# EAGLE schematic ItsyBitsy_Expander_v2.1_RP2040 (EAGLE 9.6.2)
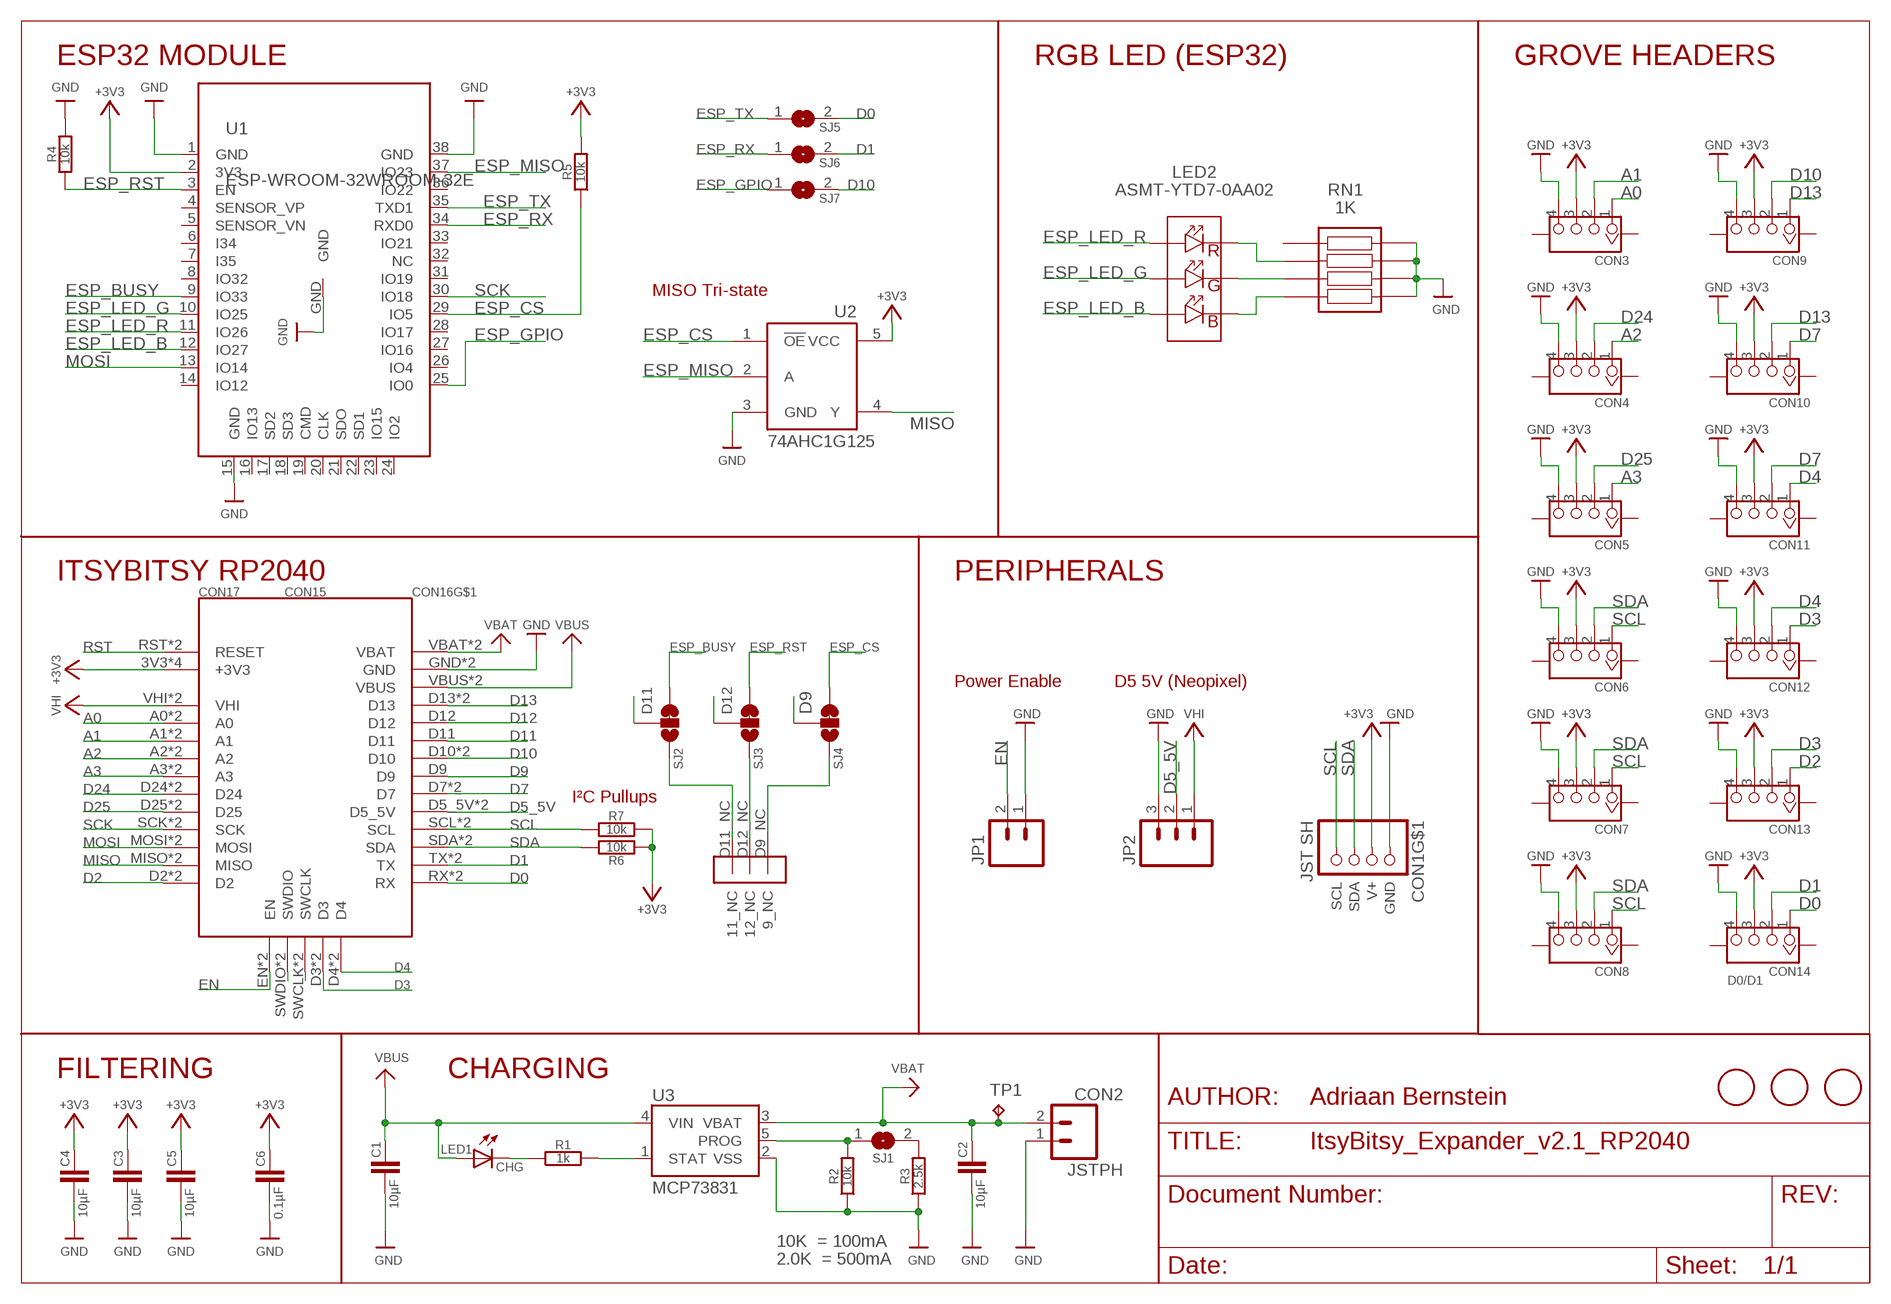
[diagram p0: schematic, sheet 1]

## Parts
C1  10µF  C-EUC0805  [C0805]
C2  10µF  C-EUC0805  [C0805]
C3  10µF  C-EUC0805  [C0805]
C4  10µF  C-EUC0805  [C0805]
C5  10µF  C-EUC0805  [C0805]
C6  0.1µF  C-EUC0805  [C0805]
CON1  JST SH  STEMMA_I2C_QT  [JST_SH4]
CON2  JSTPH  M02-JST-2MM-SMT  [JST-2-SMD]
CON3  H4P-SMD-2.0  GROVE-CONNECTOR-4PINHW4-PTH-2.0  [HW4-PTH-2.0]
CON4  H4P-SMD-2.0  GROVE-CONNECTOR-4PINHW4-PTH-2.0  [HW4-PTH-2.0]
CON5  H4P-SMD-2.0  GROVE-CONNECTOR-4PINHW4-PTH-2.0  [HW4-PTH-2.0]
CON6  H4P-SMD-2.0  GROVE-CONNECTOR-4PINHW4-PTH-2.0  [HW4-PTH-2.0]
CON7  H4P-SMD-2.0  GROVE-CONNECTOR-4PINHW4-PTH-2.0  [HW4-PTH-2.0]
CON8  H4P-SMD-2.0  GROVE-CONNECTOR-4PINHW4-PTH-2.0  [HW4-PTH-2.0]
CON9  H4P-SMD-2.0  GROVE-CONNECTOR-4PINHW4-PTH-2.0  [HW4-PTH-2.0]
CON10  H4P-SMD-2.0  GROVE-CONNECTOR-4PINHW4-PTH-2.0  [HW4-PTH-2.0]
CON11  H4P-SMD-2.0  GROVE-CONNECTOR-4PINHW4-PTH-2.0  [HW4-PTH-2.0]
CON12  H4P-SMD-2.0  GROVE-CONNECTOR-4PINHW4-PTH-2.0  [HW4-PTH-2.0]
CON13  H4P-SMD-2.0  GROVE-CONNECTOR-4PINHW4-PTH-2.0  [HW4-PTH-2.0]
CON14  H4P-SMD-2.0  GROVE-CONNECTOR-4PINHW4-PTH-2.0  [HW4-PTH-2.0]
CON15  ITSYBITSY_RP2040_EDGEDEBUG  [ITSYBITSY_RP2040_PTH_EDGEDEBUG]
CON16  ITSYBITSY_RP2040_EDGEGND  [ITSYBITSY_RP2040_SMD_EDGEGND]
CON17  ITSYBITSY_RP2040_EDGEPWR  [ITSYBITSY_RP2040_SMD_EDGEPWR]
FD1  FIDUCIAL  [FIDUCIAL_1MM]
FD2  FIDUCIAL  [FIDUCIAL_1MM]
FD3  FIDUCIAL  [FIDUCIAL_1MM]
JP1  M02PTH  [1X02]
JP2  M03PTH  [1X03]
LED1  CHG  LEDCHIP-LED0603  [CHIP-LED0603]
LED2  ASMT-YTD7-0AA02  [ASMTYTD70AA02]
R1  1k  R-EU_R0603  [R0603]
R2  10k  R-EU_R0603  [R0603]
R3  2.5k  R-EU_R0603  [R0603]
R4  10k  R-EU_R0603  [R0603]
R5  10k  R-EU_R0603  [R0603]
R6  10k  R-EU_R0603  [R0603]
R7  10k  R-EU_R0603  [R0603]
RN1  1K  CAY16-221J4AS  [CAY1647R0F4LF]
SJ1  SJ  [SJ]
SJ5  SJ  [SJ]
SJ6  SJ  [SJ]
SJ7  SJ  [SJ]
SJ_D11  SJ2  SJ_2WAY_CLOSED  [SJ_2WAY_CLOSED]
SJ_D12  SJ3  SJ_2WAY_CLOSED  [SJ_2WAY_CLOSED]
SJ_D13  SJ4  SJ_2WAY_CLOSED  [SJ_2WAY_CLOSED]
TP1  TPB1,27  [B1,27]
U1  ESP-WROOM-32WROOM-32E  [ESP-WROOM-32E]
U2  74AHC1G125  [SOT23-5L]
U3  MCP73831  [SOT23-5]

## Nets
2.5K: R3.2 SJ1.2
10K: R2.2 SJ1.1 U3.5(PROG)
+3V3: C3.1 C4.1 C5.1 C6.1 CON1.2(V+) CON3.3 CON4.3 CON5.3 CON6.3 CON7.3 CON8.3 CON9.3 CON10.3 CON11.3 CON12.3 CON13.3 CON14.3 CON17.3V3(+3V3) CON17.3V3_2(+3V3) CON17.3V3_3(+3V3) CON17.3V3_4(+3V3) R5.2 R6.1 R7.1 U1.2(3V3) U2.5(VCC)
+5V: CON17.VHI CON17.VHI_2(VHI) JP2.1 ; supply symbol labelled VHI
A0: CON3.1 CON17.A0 CON17.A0_2(A0)
A1: CON3.2 CON17.A1 CON17.A1_2(A1)
A2: CON4.1 CON17.A2 CON17.A2_2(A2)
A3: CON5.1 CON17.A3 CON17.A3_2(A3)
CHG: LED1.C R1.1
D0: CON14.1 CON15.RX CON15.RX_2(RX) SJ5.2
D1: CON14.2 CON16.TX CON16.TX_2(TX) SJ6.2
D2: CON13.1 CON15.D2 CON15.D2_2(D2)
D3: CON12.1 CON13.2 CON15.D3 CON15.D3_2(D3)
D4: CON11.1 CON12.2 CON15.D4 CON15.D4_2(D4)
D5_5V: CON16.D5_5V CON16.D5_5V_2(D5_5V) JP2.2
D7: CON10.1 CON11.2 CON16.D7 CON16.D7_2(D7)
D9: CON16.D9 SJ_D13.2
D9_NC: CON16.D9_NC(9_NC) SJ_D13.3
D10: CON9.2 CON16.D10 CON16.D10_2(D10) SJ7.2
D11: CON16.D11 SJ_D11.2
D11_NC: CON16.D11_NC(11_NC) SJ_D11.3
D12: CON16.D12 SJ_D12.2
D12_NC: CON16.D12_NC(12_NC) SJ_D12.3
D13: CON9.1 CON10.2 CON16.D13 CON16.D13_2(D13)
D24: CON4.2 CON17.D24 CON17.D24_2(D24)
D25: CON5.2 CON17.D25 CON17.D25_2(D25)
EN: CON15.EN CON15.EN_2(EN) JP1.2
ESP_BUSY: SJ_D11.1 U1.9(IO33)
ESP_CS: R5.1 SJ_D13.1 U1.29(IO5) U2.1(!OE)
ESP_GPIO: SJ7.1 U1.25(IO0)
ESP_LED_B: LED2.6(A_BLUE) U1.12(IO27)
ESP_LED_G: LED2.5(A_GREEN) U1.10(IO25)
ESP_LED_R: LED2.4(A_RED) U1.11(IO26)
ESP_MISO: U1.37(IO23) U2.2(A)
ESP_RST: R4.1 SJ_D12.1 U1.3(EN)
ESP_RX: SJ6.1 U1.34(RXD0)
ESP_TX: SJ5.1 U1.35(TXD1)
GND: C1.2 C2.2 C3.2 C4.2 C5.2 C6.2 CON1.1(GND) CON2.1 CON3.4 CON4.4 CON5.4 CON6.4 CON7.4 CON8.4 CON9.4 CON10.4 CON11.4 CON12.4 CON13.4 CON14.4 CON16.GND CON16.GND_2(GND) JP1.1 JP2.3 R2.1 R3.1 R4.2 RN1.5(R4_2) RN1.6(R3_2) RN1.7(R2_2) RN1.8(R1_2) U1.1(GND) U1.15(GND) U1.38(GND) U1.GND U2.3(GND) U3.2(VSS)
MISO: CON17.MISO CON17.MISO_2(MISO) U2.4(Y)
MOSI: CON17.MOSI CON17.MOSI_2(MOSI) U1.13(IO14)
N$1: LED2.2(K_GREEN) RN1.3(R3_1)
N$2: LED2.1(K_BLUE) RN1.4(R4_1)
N$3: LED2.3(K_RED) RN1.2(R2_1)
N$5: CON15.SWDIO CON15.SWDIO_2(SWDIO)
N$6: CON15.SWCLK CON15.SWCLK_2(SWCLK)
RST: CON17.RST(RESET) CON17.RST_2(RESET)
SCK: CON17.SCK CON17.SCK_2(SCK) U1.30(IO18)
SCL: CON1.4(SCL) CON6.1 CON7.1 CON8.1 CON16.SCL CON16.SCL_2(SCL) R7.2
SDA: CON1.3(SDA) CON6.2 CON7.2 CON8.2 CON16.SDA CON16.SDA_2(SDA) R6.2
STAT: R1.2 U3.1(STAT)
VBAT: C2.1 CON2.2 CON16.VBAT CON16.VBAT_2(VBAT) TP1.TP U3.3(VBAT)
VBUS: C1.1 CON16.VBUS CON16.VBUS_2(VBUS) LED1.A U3.4(VIN)
Unconnected: CON1.MT1(MT) CON1.MT2(MT) CON3.5(SS1) CON3.6(SS2) CON4.5(SS1) CON4.6(SS2) CON5.5(SS1) CON5.6(SS2) CON6.5(SS1) CON6.6(SS2) CON7.5(SS1) CON7.6(SS2) CON8.5(SS1) CON8.6(SS2) CON9.5(SS1) CON9.6(SS2) CON10.5(SS1) CON10.6(SS2) CON11.5(SS1) CON11.6(SS2) CON12.5(SS1) CON12.6(SS2) CON13.5(SS1) CON13.6(SS2) CON14.5(SS1) CON14.6(SS2) RN1.1(R1_1) U1.4(SENSOR_VP) U1.5(SENSOR_VN) U1.6(I34) U1.7(I35) U1.8(IO32) U1.14(IO12) U1.16(IO13) U1.17(SD2) U1.18(SD3) U1.19(CMD) U1.20(CLK) U1.21(SDO) U1.22(SD1) U1.23(IO15) U1.24(IO2) U1.26(IO4) U1.27(IO16) U1.28(IO17) U1.31(IO19) U1.32(NC) U1.33(IO21) U1.36(IO22)

## Notes on the sheet
- ESP32 MODULE | RGB LED (ESP32) | GROVE HEADERS
- MISO Tri-state
- ITSYBITSY RP2040 | PERIPHERALS
- Power Enable | D5 5V (Neopixel)
- I²C Pullups
- D0/D1
- FILTERING | CHARGING
- AUTHOR: | Adriaan Bernstein
- 10K  = 100mA
- 2.0K  = 500mA

## Library data of the parts
C1-C6 = ItsyBitsy_Expander_v2.0_RP2040:C-EU: CAPACITOR, European symbol; SPICEPREFIX: C
CON1 = ItsyBitsy_Expander_v2.0_RP2040:STEMMA_I2C
CON2 JP1 = ItsyBitsy_Expander_v2.0_RP2040:M02: Header 2 Standard 2-pin 0.1" header. Use with straight break away headers (SKU : PRT-00116), right angle break away headers (PRT-00553), swiss pins (PRT-00743), machine pins (PRT-00117), and female headers (PRT-00115). Molex polarized connector foot print use with SKU : PRT-08233 with associated crimp pins and housings.
CON3-CON14 = ItsyBitsy_Expander_v2.0_RP2040:GROVE-CONNECTOR-4PIN: 320110030
CON15 = ItsyBitsy_Expander_v2.0_RP2040:ITSYBITSY_RP2040_EDGEDEBUG
CON16 = ItsyBitsy_Expander_v2.0_RP2040:ITSYBITSY_RP2040_EDGEGND
CON17 = ItsyBitsy_Expander_v2.0_RP2040:ITSYBITSY_RP2040_EDGEPWR
FD1-FD3 = ItsyBitsy_Expander_v2.0_RP2040:FIDUCIAL: For use by pick and place machines to calibrate the vision/machine, 1mm By microbuilder.eu
JP2 = ItsyBitsy_Expander_v2.0_RP2040:M03: Header 3 Standard 3-pin 0.1" header. Use with straight break away headers (SKU : PRT-00116), right angle break away headers (PRT-00553), swiss pins (PRT-00743), machine pins (PRT-00117), and female headers (PRT-00115). Molex polarized connector foot print use with SKU : PRT-08232 with associated crimp pins and housings.
LED1 = ItsyBitsy_Expander_v2.0_RP2040:LED: LED OSRAM: - CHIPLED LG R971, LG N971, LY N971, LG Q971, LY Q971, LO R971, LY R971 LH N974, LH R974 LS Q976, LO Q976, LY Q976 LO Q996 - Hyper CHIPLED LW Q18S LB Q993, LB Q99A, LB R99A - SideLED LS A670, LO A670, LY A670, LG A670, LP A670 LB A673, LV A673, LT A673, LW A673 LH A674 LY A675 LS A676, LA A676, LO A676, LY A676, LW A676 LS A679, LY A679, LG A679 - Hyper Micro SIDELED® LS Y876, LA Y876, LO Y876, LY Y876 LT Y87S - SmartLED LW L88C, LW L88S LB L89C, LB L89S, LG L890 LS L89K, LO L89K, LY L89K LS L896, LA L896, LO L896, LY L896 - TOPLED LS T670, LO T670, LY T670, LG T670, LP T670 LSG T670, LSP T670, LSY T670, LOP T670, LYG T670 LG T671, LOG T671, LSG T671 LB T673, LV T673, LT T673, LW T673 LH T674 LS T676, LA T676, LO T676, LY T676, LB T676, LH T676, LSB T676, LW T676 LB T67C, LV T67C, LT T67C, LS T67K, LO T67K, LY T67K, LW E67C LS E67B, LA E67B, LO E67B, LY E67B, LB E67C, LV E67C, LT E67C LW T67C LS T679, LY T679, LG T679 LS T770, LO T770, LY T770, LG T770, LP T770 LB T773, LV T773, LT T773, LW T773 LH T774 LS E675, LA E675, LY E675, LS T675 LS T776, LA T776, LO T776, LY T776, LB T776 LHGB T686 LT T68C, LB T68C - Hyper Mini TOPLED® LB M676 - Mini TOPLED Santana® LG M470 LS M47K, LO M47K, LY M47K Source: http://www.osram.convergy.de LUXEON: - LUMILED® LXK2-PW12-R00, LXK2-PW12-S00, LXK2-PW14-U00, LXK2-PW14-V00 LXK2-PM12-R00, LXK2-PM12-S00, LXK2-PM14-U00 LXK2-PE12-Q00, LXK2-PE12-R00, LXK2-PE12-S00, LXK2-PE14-T00, LXK2-PE14-U00 LXK2-PB12-K00, LXK2-PB12-L00, LXK2-PB12-M00, LXK2-PB14-N00, LXK2-PB14-P00, LXK2-PB14-Q00 LXK2-PR12-L00, LXK2-PR12-M00, LXK2-PR14-Q00, LXK2-PR14-R00 LXK2-PD12-Q00, LXK2-PD12-R00, LXK2-PD12-S00 LXK2-PH12-R00, LXK2-PH12-S00 LXK2-PL12-P00, LXK2-PL12-Q00, LXK2-PL12-R00 Source: www.luxeon.com KINGBRIGHT: KA-3528ASYC Source: www.kingbright.com
LED2 = ItsyBitsy_Expander_v2.0_RP2040:ASMT-YTD7-0AA02: 2.1 V, 3.1 V Blue LED PLCC 6 SMD, Broadcom ASMT-YTD7-0AA02 Source: Datasheet <https://docs.broadcom.com/docs/AV02-3873EN>; DESCRIPTION: 2.1 V, 3.1 V Blue LED PLCC 6 SMD, Broadcom ASMT-YTD7-0AA02; HEIGHT: 1.8mm; MANUFACTURER_NAME: Avago Technologies; MANUFACTURER_PART_NUMBER: ASMT-YTD7-0AA02; MOUSER_PART_NUMBER: 630-ASMT-YTD7-0AA02; MOUSER_PRICE-STOCK: https://www.mouser.co.uk/ProductDetail/Broadcom-Avago/ASMT-YTD7-0AA02?qs=eJru1qh8zu7rRIK75I%2FMLw%3D%3D
R1-R7 = ItsyBitsy_Expander_v2.0_RP2040:R-EU_: RESISTOR, European symbol; SPICEPREFIX: R
RN1 = ItsyBitsy_Expander_v2.0_RP2040:CAY16-221J4AS: Resistor Networks & Arrays 220 OHMS 5% CONV 4RES Anti-Sulfur Source: Datasheet <https://www.bourns.com/docs/Product-Datasheets/CATCAY.pdf>; DESCRIPTION: Resistor Networks & Arrays 220 OHMS 5% CONV 4RES Anti-Sulfur; HEIGHT: 0.6mm; MANUFACTURER_NAME: Bourns; MANUFACTURER_PART_NUMBER: CAY16-221J4AS; MOUSER_PART_NUMBER: 652-CAY16-221J4AS; MOUSER_PRICE-STOCK: https://www.mouser.co.uk/ProductDetail/Bourns/CAY16-221J4AS?qs=5aG0NVq1C4yxlynUNdj32A%3D%3D
SJ1 SJ5-SJ7 = ItsyBitsy_Expander_v2.0_RP2040:SJ
SJ_D11-SJ_D13 = ItsyBitsy_Expander_v2.0_RP2040:SJ_2WAY_CLOSED
TP1 = ItsyBitsy_Expander_v2.0_RP2040:TP: Test pad
U1 = ItsyBitsy_Expander_v2.0_RP2040:ESP-WROOM-32
U2 = ItsyBitsy_Expander_v2.0_RP2040:74AHC1G125
U3 = ItsyBitsy_Expander_v2.0_RP2040:MCP73831: Microchip's MCP73831 Miniature single cell, fully integrated Li-Ion, Li-polymer charge management controller http://ww1.microchip.com/downloads/en/DeviceDoc/21984a.pdf

## Net classes
3 Power: width 0.305 mm, drill 0.483 mm